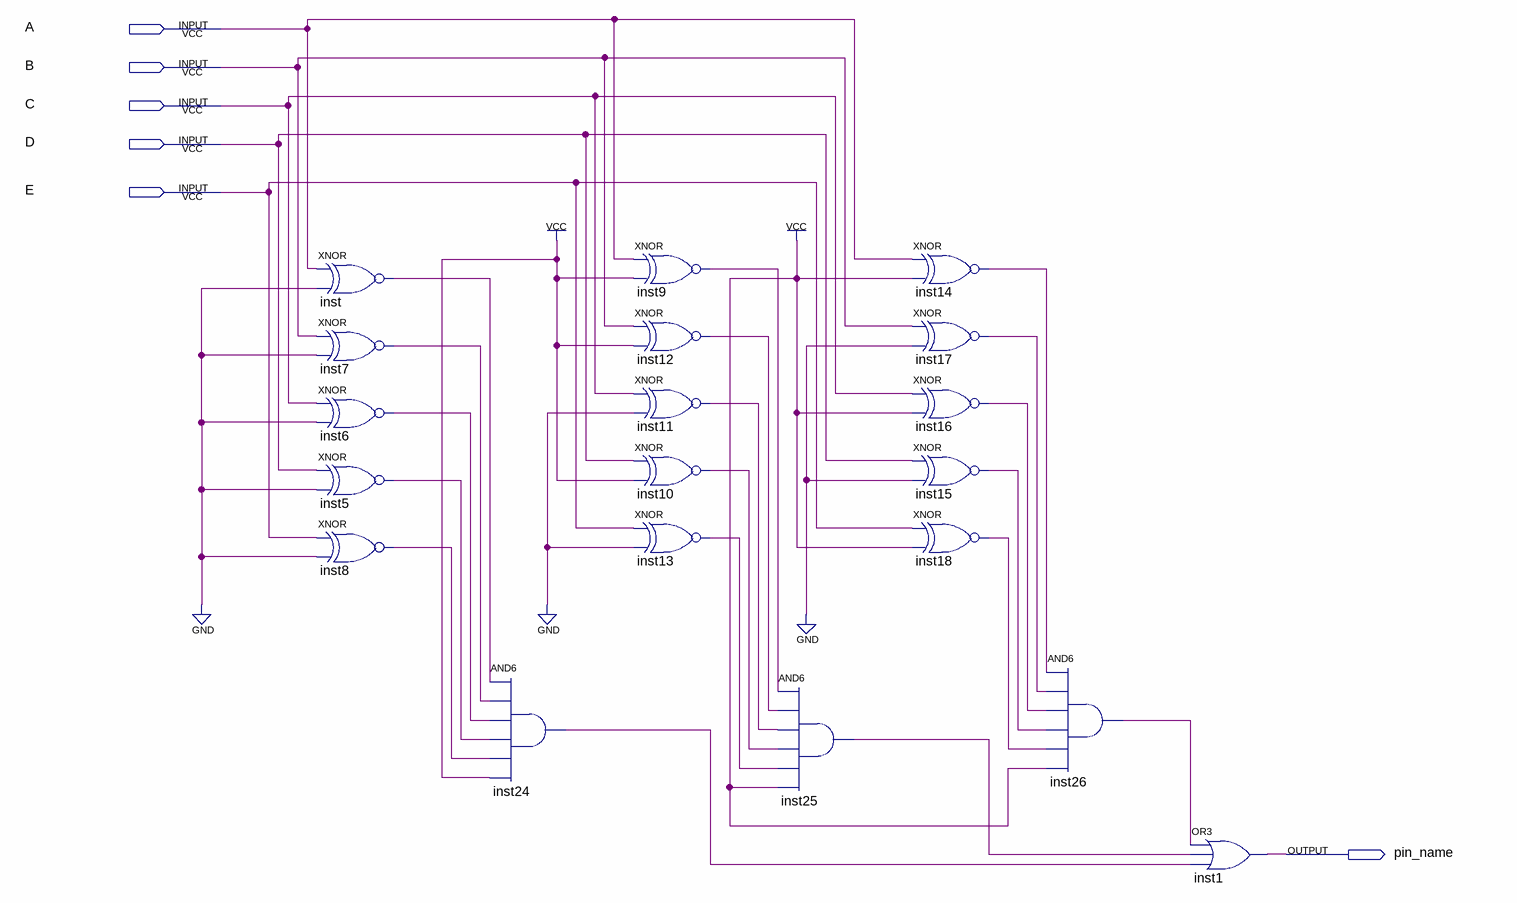
[diagram p0: schematic sheet]
// Quartus schematic check11.bdf as structural Verilog: 19 symbols, 6 pins
module check11 (
  input  A,
  input  B,
  input  C,
  input  D,
  input  E,
  output pin_name
);

  wire inst5_out, inst6_out, inst7_out, inst8_out, inst9_out, inst10_out, inst11_out, inst12_out, inst13_out,
       inst14_out, inst15_out, inst16_out, inst17_out, inst18_out, inst24_out, inst25_out, inst26_out,
       inst_out;

  xnor inst (inst_out, A, 1'b0);
  xnor inst7 (inst7_out, B, 1'b0);
  xnor inst6 (inst6_out, C, 1'b0);
  xnor inst5 (inst5_out, D, 1'b0);
  xnor inst8 (inst8_out, E, 1'b0);
  and inst24 (inst24_out, inst_out, inst7_out, inst6_out, inst5_out, inst8_out, 1'b1);
  xnor inst9 (inst9_out, A, 1'b1);
  xnor inst12 (inst12_out, B, 1'b1);
  xnor inst11 (inst11_out, C, 1'b0);
  xnor inst10 (inst10_out, D, 1'b1);
  xnor inst13 (inst13_out, E, 1'b0);
  and inst25 (inst25_out, inst9_out, inst12_out, inst11_out, inst10_out, inst13_out, 1'b1);
  xnor inst14 (inst14_out, A, 1'b1);
  xnor inst17 (inst17_out, B, 1'b0);
  xnor inst16 (inst16_out, C, 1'b1);
  xnor inst15 (inst15_out, D, 1'b0);
  xnor inst18 (inst18_out, E, 1'b1);
  and inst26 (inst26_out, inst14_out, inst17_out, inst16_out, inst15_out, inst18_out, 1'b1);
  or inst1 (pin_name, inst26_out, inst25_out, inst24_out);
endmodule
